# Altium schematic sheet AD9854.SchDoc
size A4
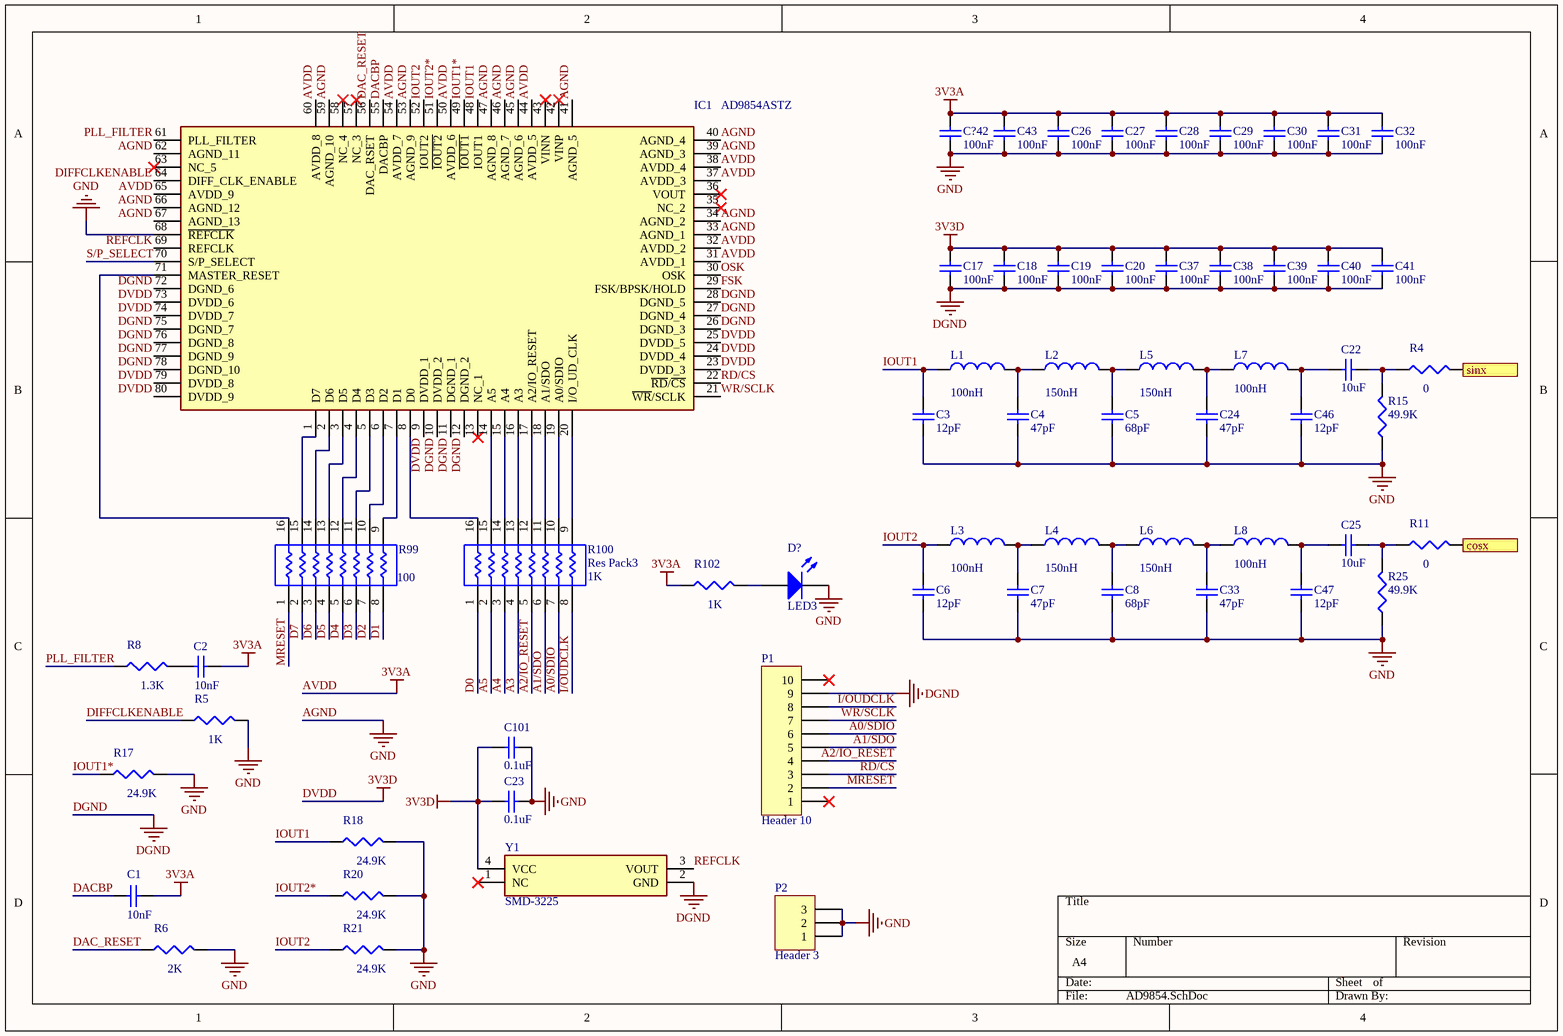
[diagram p0: AD9854.SchDoc]

## Parts
C1  value 10nF  [C1206]  (hidden comment: Cap Semi)
C2  value 10nF  [C1206]  (hidden comment: Cap Semi)
C3  value 12pF  [C1206]  (hidden comment: Cap Semi)
C4  value 47pF  [C1206]  (hidden comment: Cap Semi)
C5  value 68pF  [C1206]  (hidden comment: Cap Semi)
C6  value 12pF  [C1206]  (hidden comment: Cap Semi)
C7  value 47pF  [C1206]  (hidden comment: Cap Semi)
C8  value 68pF  [C1206]  (hidden comment: Cap Semi)
C17  value 100nF  [C1206]  (hidden comment: Cap Semi)
C18  value 100nF  [C1206]  (hidden comment: Cap Semi)
C19  value 100nF  [C1206]  (hidden comment: Cap Semi)
C20  value 100nF  [C1206]  (hidden comment: Cap Semi)
C22  value 10uF  [C1206]  (hidden comment: Cap Semi)
C23  value 0.1uF  [C1206]  (hidden comment: Cap Semi)
C24  value 47pF  [C1206]  (hidden comment: Cap Semi)
C25  value 10uF  [C1206]  (hidden comment: Cap Semi)
C26  value 100nF  [C1206]  (hidden comment: Cap Semi)
C27  value 100nF  [C1206]  (hidden comment: Cap Semi)
C28  value 100nF  [C1206]  (hidden comment: Cap Semi)
C29  value 100nF  [C1206]  (hidden comment: Cap Semi)
C30  value 100nF  [C1206]  (hidden comment: Cap Semi)
C31  value 100nF  [C1206]  (hidden comment: Cap Semi)
C32  value 100nF  [C1206]  (hidden comment: Cap Semi)
C33  value 47pF  [C1206]  (hidden comment: Cap Semi)
C37  value 100nF  [C1206]  (hidden comment: Cap Semi)
C38  value 100nF  [C1206]  (hidden comment: Cap Semi)
C39  value 100nF  [C1206]  (hidden comment: Cap Semi)
C40  value 100nF  [C1206]  (hidden comment: Cap Semi)
C41  value 100nF  [C1206]  (hidden comment: Cap Semi)
C43  value 100nF  [C1206]  (hidden comment: Cap Semi)
C46  value 12pF  [C1206]  (hidden comment: Cap Semi)
C47  value 12pF  [C1206]  (hidden comment: Cap Semi)
C101  value 0.1uF  [C1206]  (hidden comment: Cap Semi)
C?42  value 100nF  [C1206]  (hidden comment: Cap Semi)
D?  LED3  [3.5X2.8X1.9]
IC1  AD9854ASTZ  [QFP65P1600X1600X160-80N]
L1  value 100nH  [0402-A]  (hidden comment: Inductor)
L2  value 150nH  [0402-A]  (hidden comment: Inductor)
L3  value 100nH  [0402-A]  (hidden comment: Inductor)
L4  value 150nH  [0402-A]  (hidden comment: Inductor)
L5  value 150nH  [0402-A]  (hidden comment: Inductor)
L6  value 150nH  [0402-A]  (hidden comment: Inductor)
L7  value 100nH  [0402-A]  (hidden comment: Inductor)
L8  value 100nH  [0402-A]  (hidden comment: Inductor)
P1  Header 10  [HDR1X10]
P2  Header 3  [HDR1X3]
R4  value 0  [J1-0603]  (hidden comment: Res3)
R5  value 1K  [J1-0603]  (hidden comment: Res3)
R6  value 2K  [J1-0603]  (hidden comment: Res3)
R8  value 1.3K  [J1-0603]  (hidden comment: Res3)
R11  value 0  [J1-0603]  (hidden comment: Res3)
R15  value 49.9K  [J1-0603]  (hidden comment: Res3)
R17  value 24.9K  [J1-0603]  (hidden comment: Res3)
R18  value 24.9K  [J1-0603]  (hidden comment: Res3)
R20  value 24.9K  [J1-0603]  (hidden comment: Res3)
R21  value 24.9K  [J1-0603]  (hidden comment: Res3)
R25  value 49.9K  [J1-0603]  (hidden comment: Res3)
R99  value 100  [SO-16_N]  (hidden comment: Res Pack3)
R100  Res Pack3  value 1K  [SO-16_N]
R102  value 1K  [J1-0603]  (hidden comment: Res3)
Y1  SMD-3225  [SMD3225_4P20MHZ20PF10PPM]

## Ports
cosx (out), sinx (out)

## Nets
AGND: C3.1 C4.1 C5.1 C6.1 C7.1 C8.1 C23.1 C24.1 C26.1 C27.1 C28.1 C29.1 C30.1 C31.1 C32.1 C33.1 C43.1 C46.1 C47.1 C101.1 C?42.1 D?.2(K) IC1.33(AGND_1) IC1.34(AGND_2) IC1.39(AGND_3) IC1.40(AGND_4) IC1.41(AGND_5) IC1.45(AGND_6) IC1.46(AGND_7) IC1.47(AGND_8) IC1.53(AGND_9) IC1.59(AGND_10) IC1.62(AGND_11) IC1.66(AGND_12) IC1.67(AGND_13) IC1.68(~{REFCLK}) P2.1 P2.2 P2.3 R5.2 R6.2 R15.1 R17.2 R18.2 R20.2 R21.2 R25.1  [also labelled GND]
AVDD: C1.2 C2.2 C26.2 C27.2 C28.2 C29.2 C30.2 C31.2 C32.2 C43.2 C?42.2 IC1.31(AVDD_1) IC1.32(AVDD_2) IC1.37(AVDD_3) IC1.38(AVDD_4) IC1.44(AVDD_5) IC1.50(AVDD_6) IC1.54(AVDD_7) IC1.60(AVDD_8) IC1.65(AVDD_9) R102.1  [also labelled 3V3A]
DGND: C17.1 C18.1 C19.1 C20.1 C37.1 C38.1 C39.1 C40.1 C41.1 IC1.10(DVDD_2) IC1.11(DGND_1) IC1.12(DGND_2) IC1.26(DGND_3) IC1.27(DGND_4) IC1.28(DGND_5) IC1.72(DGND_6) IC1.75(DGND_7) IC1.76(DGND_8) IC1.77(DGND_9) IC1.78(DGND_10) P1.9 Y1.2(GND)
DVDD: C17.2 C18.2 C19.2 C20.2 C23.2 C37.2 C38.2 C39.2 C40.2 C41.2 C101.2 IC1.9(DVDD_1) IC1.23(DVDD_3) IC1.24(DVDD_4) IC1.25(DVDD_5) IC1.73(DVDD_6) IC1.74(DVDD_7) IC1.79(DVDD_8) IC1.80(DVDD_9) Y1.4(VCC)  [also labelled 3V3D]
A0/SDIO: P1.6 R100.7
A1/SDO: P1.5 R100.6
A2/IO_RESET: P1.4 R100.5
A3: R100.4
A4: R100.3
A5: R100.2
cosx: R11.2 ; port cosx
D0: R100.1
D1: R99.8
D2: R99.7
D3: R99.6
D4: R99.5
D5: R99.4
D6: R99.3
D7: R99.2
DAC_RESET: IC1.56(DAC_RSET) R6.1
DACBP: C1.1 IC1.55(DACBP)
DIFFCLKENABLE: IC1.64(DIFF_CLK_ENABLE) R5.1
FSK: IC1.29(FSK/BPSK/HOLD)
I/OUDCLK: P1.8 R100.8
IOUT1: C3.2 IC1.48(IOUT1) L1.1 R18.1
IOUT1*: IC1.49(~{IOUT1}) R17.1
IOUT2: C6.2 IC1.52(IOUT2) L3.1 R21.1
IOUT2*: IC1.51(~{IOUT2}) R20.1
MRESET: P1.2 R99.1
OSK: IC1.30(OSK)
PLL_FILTER: IC1.61(PLL_FILTER) R8.1
RD/CS: IC1.22(~{RD}/~{CS}) P1.3
REFCLK: IC1.69(REFCLK) Y1.3(VOUT)
S/P_SELECT: IC1.70(S/P_SELECT)
sinx: R4.2 ; port sinx
WR/SCLK: IC1.21(~{WR}/SCLK) P1.7
NetC2_1: C2.1 R8.2
NetC4_2: C4.2 L1.2 L2.1
NetC5_2: C5.2 L2.2 L5.1
NetC7_2: C7.2 L3.2 L4.1
NetC8_2: C8.2 L4.2 L6.1
NetC22_1: C22.1 R4.1 R15.2
NetC22_2: C22.2 C46.2 L7.2
NetC24_2: C24.2 L5.2 L7.1
NetC25_1: C25.1 R11.1 R25.2
NetC25_2: C25.2 C47.2 L8.2
NetC33_2: C33.2 L6.2 L8.1
NetD?_1: D?.1(A) R102.2
NetIC1_1: IC1.1(D7) R99.15
NetIC1_2: IC1.2(D6) R99.14
NetIC1_3: IC1.3(D5) R99.13
NetIC1_4: IC1.4(D4) R99.12
NetIC1_5: IC1.5(D3) R99.11
NetIC1_6: IC1.6(D2) R99.10
NetIC1_7: IC1.7(D1) R99.9
NetIC1_8: IC1.8(D0) R100.16
NetIC1_14: IC1.14(A5) R100.15
NetIC1_15: IC1.15(A4) R100.14
NetIC1_16: IC1.16(A3) R100.13
NetIC1_17: IC1.17(A2/IO_RESET) R100.12
NetIC1_18: IC1.18(A1/SDO) R100.11
NetIC1_19: IC1.19(A0/SDIO) R100.10
NetIC1_20: IC1.20(I/O_UD_CLK) R100.9
NetIC1_71: IC1.71(MASTER_RESET) R99.16

Not connected (* = marked no-connect by the designer): IC1 13(NC_1)* 35(NC_2)* 36(VOUT)* 42(VINP)* 43(VINN)* 57(NC_3)* 58(NC_4)* 63(NC_5)*; P1 1* 10*; Y1 1(NC)*

## Library data of the parts
C1-C8 C17-C20 C22-C33 C37-C41 C43 C46 C47 C101 C?42 = Cap Semi: Capacitor (Semiconductor SIM Model); Published: 8-Jun-2000; LatestRevisionDate: 29-May-2009; LatestRevisionNote: IPC-7351 Footprint Added.; PackageReference: C1206; Publisher: Altium Limited; PackageDescription: Chip Capacitor
D? = LED3: Typical BLUE SiC LED; Published: 8-Jun-2000; LatestRevisionDate: 17-Dec-2003; LatestRevisionNote: PCB Footprint replaced.; DatasheetVersion: 16-Apr-2002; PackageVersion: 16-Apr-2002; PackageReference: 3.5X2.8X1.9; Publisher: Altium Limited; PackageDescription: SM LED; 2 C-Bend Leads; Body 3.5 x 2.8 x 1.9 mm, inc leads (LxWxH typ)
IC1 = AD9854ASTZ: Integrated Circuit; Manufacturer_Name: Analog Devices; Datasheet Link: https://datasheet.datasheetarchive.com/originals/distributors/Datasheets-4/DSA-69965.pdf; Height: 1.6mm; Manufacturer_Part_Number: AD9854ASTZ; Mouser Part Number: 584-AD9854ASTZ; Mouser Price/Stock: https://www.mouser.co.uk/ProductDetail/Analog-Devices/AD9854ASTZ?qs=BpaRKvA4VqGqrlqSiFw07Q%3D%3D; Arrow Part Number: AD9854ASTZ; Arrow Price/Stock: https://www.arrow.com/en/products/ad9854astz/analog-devices
L1-L8 = Inductor: Code_IEC: 1005; Published: 8-Jun-2000; LatestRevisionDate: 29-May-2009; LatestRevisionNote: IPC-7351 Footprint Added.; PackageReference: 0402-A; Publisher: Altium Limited; PackageDescription: Chip Inductor; Code_JEITA: 0402
P1 = Header 10: Header, 10-Pin; LatestRevisionDate: 17-Jul-2002; LatestRevisionNote: Re-released for DXP Platform.; Publisher: Altium Limited
P2 = Header 3: Header, 3-Pin; LatestRevisionDate: 17-Jul-2002; LatestRevisionNote: Re-released for DXP Platform.; Publisher: Altium Limited
R4-R6 R8 R11 R15 R17 R18 R20 R21 R25 R102 = Res3: Resistor; Published: 8-Jun-2000; LatestRevisionDate: 29-May-2009; LatestRevisionNote: IPC-7351 Footprint Added.; PackageReference: J1-0603; Publisher: Altium Limited; PackageDescription: Chip Resistor
R99 R100 = Res Pack3: Isolated Resistor Network; Published: 24-Mar-1999; LatestRevisionDate: 29-May-2009; LatestRevisionNote: IPC-7351 Footprint Added.; PackageReference: SO-16; Publisher: Altium Limited; PackageDescription: 16-Pin Small Outline Integrated Circuit 1.27 mm Pitch; Code_JEDEC: MS-012-AC; Code_IPC: SOIC127P600-16
Y1 = SMD-3225_4P20MHZ20PF10PPM: Crystal or Oscillator; Manufacturer_Name: Zhejiang Abel Elec; Datasheet Link: https://datasheet.lcsc.com/szlcsc/Zhejiang-Abel-Elec-SMD-3225-4P20MHZ20PF10PPM_C172730.pdf; Height: 0.8mm; Manufacturer_Part_Number: SMD-3225_4P20MHZ20PF10PPM